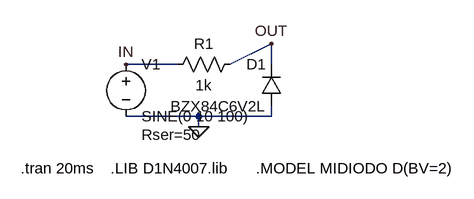
[diagram p0: schematic Ejercicio1.asc]
Ejercicio1.asc, the LTspice schematic file:
Version 4
SHEET 1 880 680
WIRE 112 144 32 144
WIRE 192 144 256 112
WIRE 256 144 256 112
WIRE 144 224 32 224
WIRE 256 224 256 208
WIRE 256 224 144 224
WIRE 144 240 144 224
FLAG 144 240 0
FLAG 32 144 IN
FLAG 256 112 OUT
SYMBOL res 208 128 R90
WINDOW 0 0 56 VBottom 2
WINDOW 3 32 56 VTop 2
SYMATTR InstName R1
SYMATTR Value 1k
SYMBOL voltage 32 128 R0
WINDOW 123 0 0 Left 0
WINDOW 39 24 124 Left 2
SYMATTR InstName V1
SYMATTR Value SINE(0 10 100)
SYMATTR SpiceLine Rser=50
SYMBOL diode 272 208 R180
WINDOW 0 24 64 Left 2
WINDOW 3 24 0 Left 2
SYMATTR InstName D1
SYMATTR Value BZX84C6V2L
TEXT -130 304 Left 2 !.tran 20ms
TEXT 232 304 Left 2 !.MODEL MIDIODO D(BV=2)
TEXT 8 304 Left 2 !.LIB D1N4007.lib

The netlist it stands for:
* Ejercicio1.asc
R1 OUT IN 1k
V1 IN 0 SINE(0 10 100) Rser=50
D1 0 OUT BZX84C6V2L
.model D D
.lib standard.dio
.tran 20ms
.MODEL MIDIODO D(BV=2)
.LIB D1N4007.lib
.backanno
.end